# Altium schematic sheet EDU_High-Speed-Design_CPU_HDMI.SchDoc: CPU HDMI
size 279 x 215 mm; Date: not used; ApprovedBy: not used; CheckedBy: not used; Author: not used; DrawnBy: not used; Organization: not used; Address4: not used; SheetNumber: 19; SheetTotal: 26; Time: not used; ImagePath: not used; Application_BuildNumber: not used
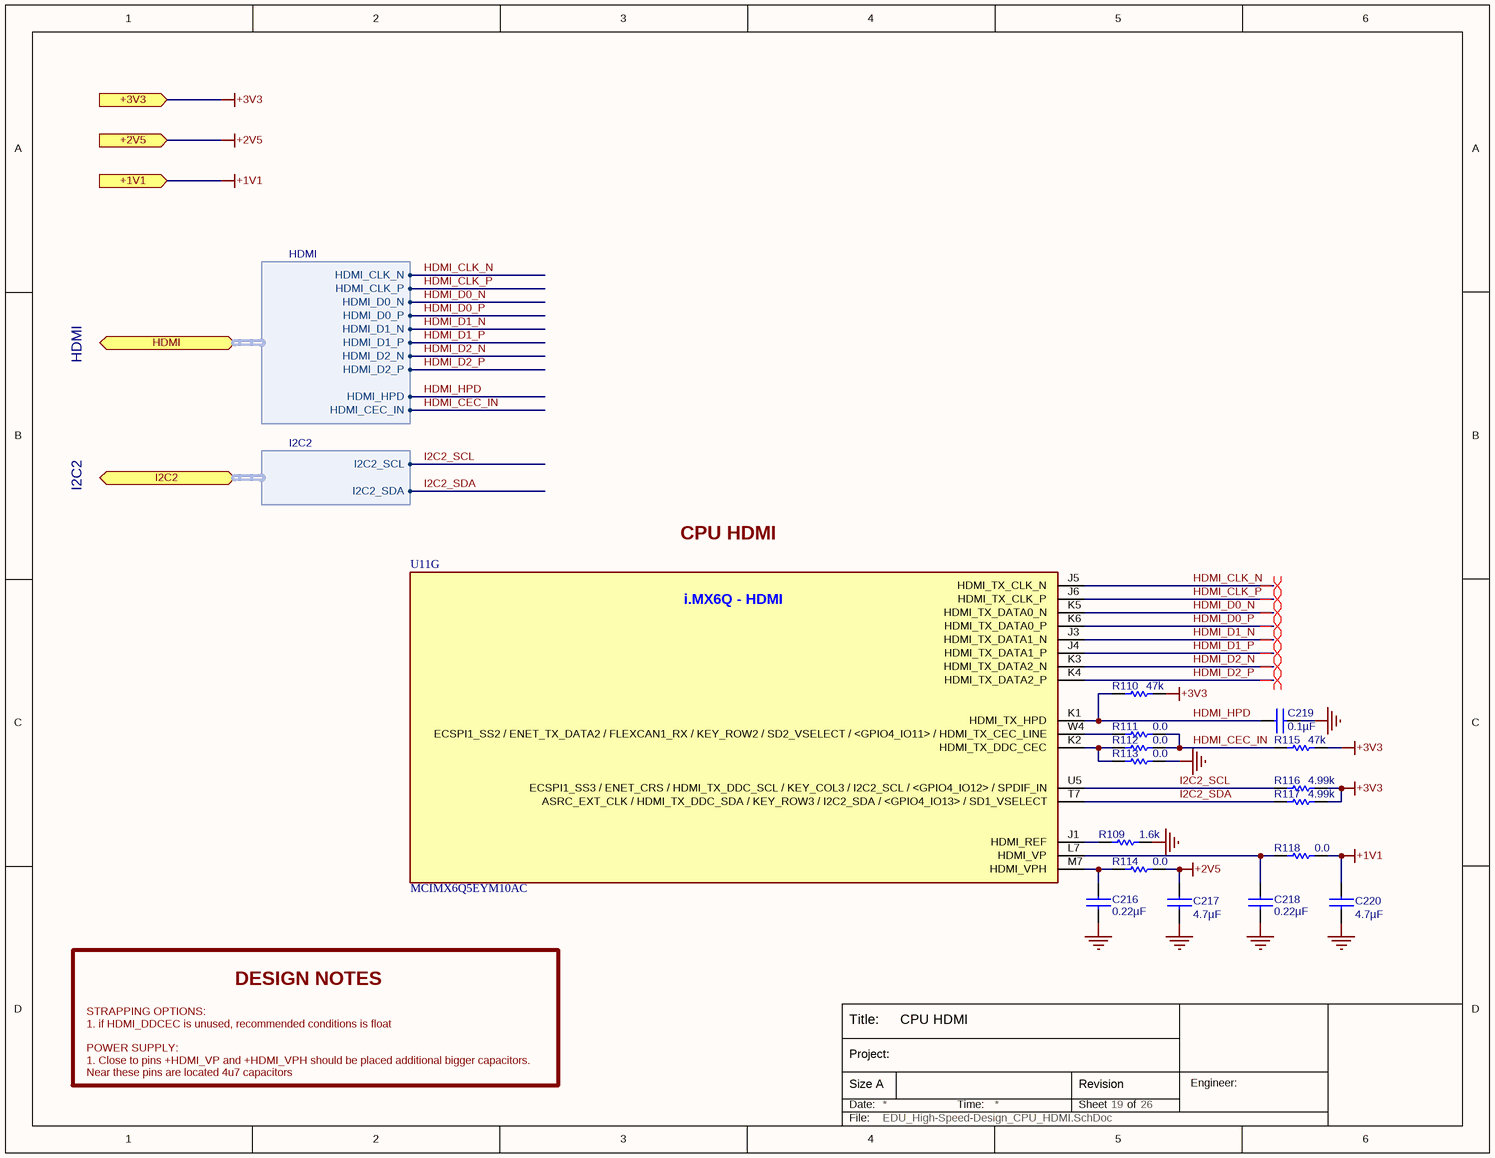
[diagram p0: EDU_High-Speed-Design_CPU_HDMI.SchDoc]

## Parts
C216  0.22µF  [C0402]
C217  4.7µF  [C0402]
C218  0.22µF  [C0402]
C219  0.1µF  [C0402]
C220  4.7µF  [C0402]
R109  1.6k  [R0402]
R110  47k  [R0402]
R111  0.0  [R0402]
R112  0.0  [R0402]
R113  0.0  [R0402]
R114  0.0  [R0402]
R115  47k  [R0402]
R116  4.99k  [R0402]
R117  4.99k  [R0402]
R118  0.0  [R0402]
U11  MCIMX6Q5EYM10AC  [MCIMX6Q5EYM10AC]  (part G of 15)

## Ports
+1V1 (in), +2V5 (in), +3V3 (in), HDMI (bidir, harness HDMI), I2C2 (bidir, harness I2C2)

## Harnesses
HDMI: HDMI_CLK_N, HDMI_D0_P, HDMI_D1_N, HDMI_D0_N, HDMI_D1_P, HDMI_CLK_P, HDMI_D2_N, HDMI_D2_P, HDMI_HPD, HDMI_CEC_IN
I2C2: I2C2_SCL, I2C2_SDA

## Nets
+1V1: C220.1 R118.2 ; port +1V1
+2V5: C217.1 R114.2 ; port +2V5
+3V3: R110.1 R115.1 R116.1 R117.1 ; port +3V3
GND: C216.2 C217.2 C218.2 C219.2 C220.2 R109.1 R113.1
HDMI_CEC_IN: R111.1 R112.1 R115.2 ; port HDMI.HDMI_CEC_IN
HDMI_CLK_N: U11.J5(HDMI_TX_CLK_N) ; port HDMI.HDMI_CLK_N
HDMI_CLK_P: U11.J6(HDMI_TX_CLK_P) ; port HDMI.HDMI_CLK_P
HDMI_D0_N: U11.K5(HDMI_TX_DATA0_N) ; port HDMI.HDMI_D0_N
HDMI_D0_P: U11.K6(HDMI_TX_DATA0_P) ; port HDMI.HDMI_D0_P
HDMI_D1_N: U11.J3(HDMI_TX_DATA1_N) ; port HDMI.HDMI_D1_N
HDMI_D1_P: U11.J4(HDMI_TX_DATA1_P) ; port HDMI.HDMI_D1_P
HDMI_D2_N: U11.K3(HDMI_TX_DATA2_N) ; port HDMI.HDMI_D2_N
HDMI_D2_P: U11.K4(HDMI_TX_DATA2_P) ; port HDMI.HDMI_D2_P
HDMI_HPD: C219.1 R110.2 U11.K1(HDMI_TX_HPD) ; port HDMI.HDMI_HPD
I2C2_SCL: R116.2 U11.U5(ECSPI1_SS3_/_ENET_CRS_/_HDMI_TX_DDC_SCL_/_KEY_COL3_/_I2C2_SCL_/_<GPIO4_IO12>_/_SPDIF_IN) ; port I2C2.I2C2_SCL
I2C2_SDA: R117.2 U11.T7(ASRC_EXT_CLK_/_HDMI_TX_DDC_SDA_/_KEY_ROW3_/_I2C2_SDA_/_<GPIO4_IO13>_/_SD1_VSELECT) ; port I2C2.I2C2_SDA
NetC216_1: C216.1 R114.1 U11.M7(HDMI_VPH)
NetC218_1: C218.1 R118.1 U11.L7(HDMI_VP)
NetR109_2: R109.2 U11.J1(HDMI_REF)
NetR111_2: R111.2 U11.W4(ECSPI1_SS2_/_ENET_TX_DATA2_/_FLEXCAN1_RX_/_KEY_ROW2_/_SD2_VSELECT_/_<GPIO4_IO11>_/_HDMI_TX_CEC_LINE)
NetR112_2: R112.2 R113.2 U11.K2(HDMI_TX_DDC_CEC)

## Layout directives
differential pair: HDMI_CLK_N, HDMI_CLK_P, HDMI_D0_N, HDMI_D0_P, HDMI_D1_N, HDMI_D1_P, HDMI_D2_N, HDMI_D2_P

## Notes on the sheet
- HDMI
- I2C2
- CPU HDMI
- DESIGN NOTES
- STRAPPING OPTIONS:
  1. if HDMI_DDCEC is unused, recommended conditions is float
  POWER SUPPLY:
  1. Close to pins +HDMI_VP and +HDMI_VPH should be placed additional bigger capacitors. Near these pins are located 4u7 capacitors
- Title:
- Date:
- Size A
- Project:
- Time:
- Sheet
- Revision
- of
- Engineer:
- File:
- (in symbol MCIMX6Q5EYM10AC, part G) i.MX6Q - HDMI

## Library data of the parts
C216 C218 = C1005X5R1E224M: CAP CER .22UF 25V X5R 20% 0402; Manufacturer 1: TDK Corporation; Capacitance: 0.22µF; Manufacturer Part Number 1: C1005X5R1E224M; Voltage: 25V; Supplier 1: Digi-Key; Supplier Part Number 1: 445-5945-1-ND; ComponentLink1URL: http://www.tdk.co.jp/tefe02/e412_c.pdf; ComponentLink1Description: http://www.tdk.co.jp/tefe02/e412_c.pdf
C217 C220 = C1005X5R1A475M: CAP CER 4.7UF 10V 20% X5R 0402; Manufacturer 1: TDK Corporation; Supplier 1: Digi-Key; Supplier Part Number 1: 445-8023-1-ND; Manufacturer Part Number 1: C1005X5R1A475M; Capacitance: 4.7µF; Voltage: 10V; ComponentLink1URL: http://www.tdk.com/pdf/general_B11.pdf; ComponentLink1Description: http://www.tdk.com/pdf/general_B11.pdf
C219 = C1005X5R1H104K: CAP CER .10UF 50V X5R 10% 0402; Manufacturer 1: TDK Corporation; Capacitance: 0.1µF; Manufacturer Part Number 1: C1005X5R1H104K; Voltage: 50V; Supplier 1: Digi-Key; Supplier Part Number 1: 445-5942-1-ND; ComponentLink1URL: http://www.tdk.co.jp/tefe02/e412_c.pdf; ComponentLink1Description: http://www.tdk.co.jp/tefe02/e412_c.pdf
R109 = ERJ-2RKF1601X: RES 1.6K OHM 1/10W 1% 0402 SMD; Manufacturer 1: Panasonic Electronic Components; Supplier 1: Digi-Key; Manufacturer Part Number 1: ERJ-2RKF1601X; Resistance: 1.6k; ComponentLink1URL: http://industrial.panasonic.com/www-cgi/jvcr13pz.cgi?E+PZ+3+AOA0002+ERJ2RKF1601X+7+WW; ComponentLink1Description: http://industrial.panasonic.com/www-cgi/jvcr13pz.cgi?E+PZ+3+AOA0002+ERJ2RKF1601X+7+WW; Supplier Part Number 1: P1.60KLCT-ND
R110 R115 = RC0402FR-0747KL: RES 47.0K OHM 1/16W 1% 0402 SMD; Manufacturer: Yageo; Manufacturer Part Number: RC0402FR-0747KL; Resistance: 47k; Supplier 1: Digi-Key; Supplier Part Number 1: 311-47.0KLRCT-ND; ComponentLink1URL: http://www.yageo.com/documents/recent/PYu-RC0402_51_RoHS_L_6.pdf; ComponentLink1Description: http://www.yageo.com/documents/recent/PYu-RC0402_51_RoHS_L_6.pdf
R111-R114 R118 = RC0402JR-070RL: RES 0.0 OHM 1/16W 0402 SMD; Manufacturer 1: Yageo; Manufacturer Part Number 1: RC0402JR-070RL; Resistance: 0.0; Supplier 1: Digi-Key; Supplier Part Number 1: 311-0.0JRCT-ND; ComponentLink1URL: http://www.yageo.com/documents/recent/PYu-RC0402_51_RoHS_L_6.pdf; ComponentLink1Description: http://www.yageo.com/documents/recent/PYu-RC0402_51_RoHS_L_6.pdf
R116 R117 = RMCF0402FT4K99: RES TF 4.99K OHM 1% 1/16W 0402; Manufacturer 1: Stackpole Electronics Inc; Manufacturer Part Number 1: RMCF0402FT4K99; Resistance: 4.99k; Supplier 1: Digi-Key; Supplier Part Number 1: RMCF0402FT4K99CT-ND; ComponentLink1URL: http://www.seielect.com/Catalog/SEI-RMCF.pdf; ComponentLink1Description: http://www.seielect.com/Catalog/SEI-RMCF.pdf
U11 = MCIMX6Q5EYM10AC: IC MCU 32BIT ARM QUAD 624FCBGA; Manufacturer 1: Freescale Semiconductor; Supplier 1: Digi-Key; Manufacturer Part Number 1: MCIMX6Q5EYM10AC; Supplier Part Number 1: MCIMX6Q5EYM10AC-ND